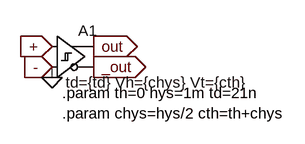
[diagram p0: schematic comp_hys-rise-fast.asc]
comp_hys-rise-fast.asc, the LTspice schematic file:
Version 4
SHEET 1 880 680
FLAG 256 80 out
IOPIN 256 80 Out
FLAG 256 112 _out
IOPIN 256 112 Out
FLAG 192 112 -
IOPIN 192 112 In
FLAG 192 80 +
IOPIN 192 80 In
FLAG 192 128 0
SYMBOL Digital\\diffschmitt 192 32 R0
WINDOW 3 21 104 Left 0
SYMATTR Value td={td} Vh={chys} Vt={cth}
SYMATTR InstName A1
TEXT 208 152 Left 0 !.param th=0 hys=1m td=21n\n.param chys=hys/2 cth=th+chys

The netlist it stands for:
* comp_hys-rise-fast.asc
A1 + - 0 0 0 _out out 0 SCHMITT td={td} Vh={chys} Vt={cth}
.param th=0 hys=1m td=21n
.param chys=hys/2 cth=th+chys
.backanno
.end